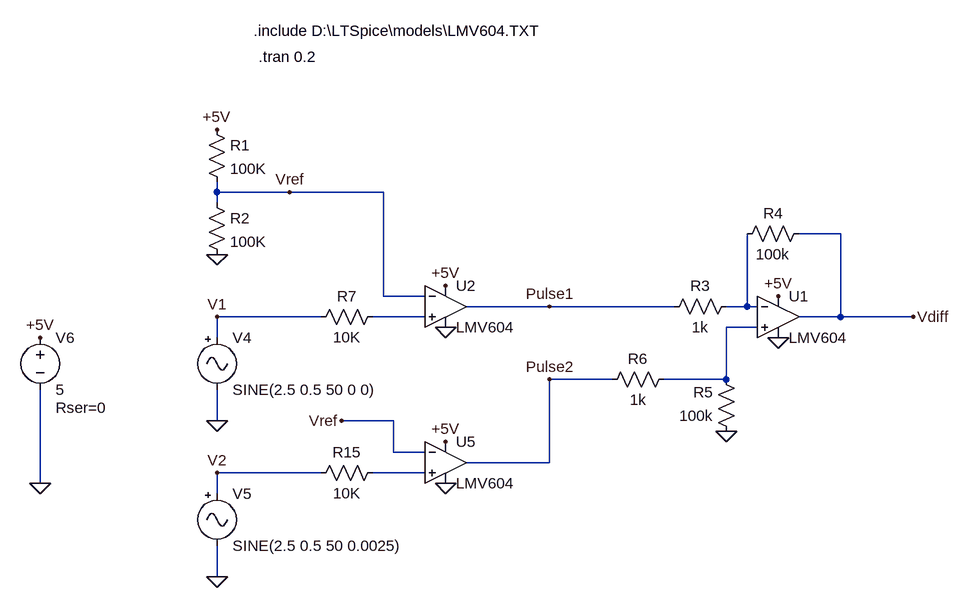
[diagram p0: schematic Phase detector.asc]
Phase detector.asc, the LTspice schematic file:
Version 4
SHEET 1 3720 2468
WIRE 2576 1600 2576 1584
WIRE 2688 1600 2576 1600
WIRE 2832 1600 2688 1600
WIRE 2576 1616 2576 1600
WIRE 3536 1664 3472 1664
WIRE 2832 1760 2832 1600
WIRE 2896 1760 2832 1760
WIRE 3088 1776 2960 1776
WIRE 3280 1776 3088 1776
WIRE 3392 1776 3392 1664
WIRE 3392 1776 3360 1776
WIRE 3408 1776 3392 1776
WIRE 2736 1792 2576 1792
WIRE 2896 1792 2816 1792
WIRE 3536 1792 3536 1664
WIRE 3536 1792 3472 1792
WIRE 3648 1792 3536 1792
WIRE 3408 1808 3360 1808
WIRE 2576 1824 2576 1792
WIRE 3184 1888 3088 1888
WIRE 3360 1888 3360 1808
WIRE 3360 1888 3264 1888
WIRE 2576 1952 2576 1904
WIRE 2848 1952 2768 1952
WIRE 2848 2000 2848 1952
WIRE 2896 2000 2848 2000
WIRE 3088 2016 3088 1888
WIRE 3088 2016 2960 2016
WIRE 2736 2032 2576 2032
WIRE 2896 2032 2816 2032
WIRE 2304 2048 2304 1904
WIRE 2576 2064 2576 2032
WIRE 2576 2192 2576 2144
FLAG 2576 1504 +5V
FLAG 2576 1696 0
FLAG 2576 1952 0
FLAG 2304 2048 0
FLAG 2304 1824 +5V
FLAG 2576 1792 V1
FLAG 2688 1600 Vref
FLAG 2576 2192 0
FLAG 2576 2032 V2
FLAG 3440 1760 +5V
FLAG 3440 1824 0
FLAG 3360 1968 0
FLAG 3648 1792 Vdiff
FLAG 2928 1744 +5V
FLAG 2928 1808 0
FLAG 2768 1952 Vref
FLAG 3088 1776 Pulse1
FLAG 3088 1888 Pulse2
FLAG 2928 1984 +5V
FLAG 2928 2048 0
SYMBOL res 2560 1488 R0
SYMATTR InstName R1
SYMATTR Value 100K
SYMBOL res 2560 1600 R0
SYMATTR InstName R2
SYMATTR Value 100K
SYMBOL Misc\\signal 2576 1808 R0
WINDOW 123 0 0 Left 0
WINDOW 39 0 0 Left 0
SYMATTR InstName V4
SYMATTR Value SINE(2.5 0.5 50 0 0)
SYMBOL Misc\\signal 2576 2048 R0
WINDOW 123 0 0 Left 0
WINDOW 39 0 0 Left 0
SYMATTR InstName V5
SYMATTR Value SINE(2.5 0.5 50 0.0025)
SYMBOL voltage 2304 1808 R0
WINDOW 123 0 0 Left 0
WINDOW 39 24 124 Left 2
SYMATTR SpiceLine Rser=0
SYMATTR InstName V6
SYMATTR Value 5
SYMBOL res 3376 1760 R90
WINDOW 0 0 56 VBottom 2
WINDOW 3 32 56 VTop 2
SYMATTR InstName R3
SYMATTR Value 1k
SYMBOL res 3376 1680 R270
WINDOW 0 32 56 VTop 2
WINDOW 3 0 56 VBottom 2
SYMATTR InstName R4
SYMATTR Value 100k
SYMBOL OpAmps\\opamp2 3440 1728 R0
SYMATTR InstName U1
SYMATTR Value LMV604
SYMBOL res 3376 1984 R180
WINDOW 0 36 76 Left 2
WINDOW 3 36 40 Left 2
SYMATTR InstName R5
SYMATTR Value 100k
SYMBOL res 3280 1872 R90
WINDOW 0 0 56 VBottom 2
WINDOW 3 32 56 VTop 2
SYMATTR InstName R6
SYMATTR Value 1k
SYMBOL OpAmps\\opamp2 2928 1712 R0
SYMATTR InstName U2
SYMATTR Value LMV604
SYMBOL OpAmps\\opamp2 2928 1952 R0
SYMATTR InstName U5
SYMATTR Value LMV604
SYMBOL res 2832 1776 R90
WINDOW 0 0 56 VBottom 2
WINDOW 3 32 56 VTop 2
SYMATTR InstName R7
SYMATTR Value 10K
SYMBOL res 2832 2016 R90
WINDOW 0 0 56 VBottom 2
WINDOW 3 32 56 VTop 2
SYMATTR InstName R15
SYMATTR Value 10K
TEXT 2632 1352 Left 2 !.include D:\\LTSpice\\models\\LMV604.TXT
TEXT 2640 1392 Left 2 !.tran 0.2

The netlist it stands for:
* Phase detector.asc
R1 +5V Vref 100K
R2 Vref 0 100K
V4 V1 0 SINE(2.5 0.5 50 0 0)
V5 V2 0 SINE(2.5 0.5 50 0.0025)
V6 +5V 0 5 Rser=0
R3 N001 Pulse1 1k
R4 N001 Vdiff 100k
XU1 N003 N001 +5V 0 Vdiff LMV604  ; pins In+ In- V+ V- OUT
R5 0 N003 100k
R6 N003 Pulse2 1k
XU2 N002 Vref +5V 0 Pulse1 LMV604  ; pins In+ In- V+ V- OUT
XU5 N004 Vref +5V 0 Pulse2 LMV604  ; pins In+ In- V+ V- OUT
R7 N002 V1 10K
R15 N004 V2 10K
.include D:\LTSpice\models\LMV604.TXT
.tran 0.2
.backanno
.end